# EAGLE design main-pcb@aveon (EAGLE 9.6.2)
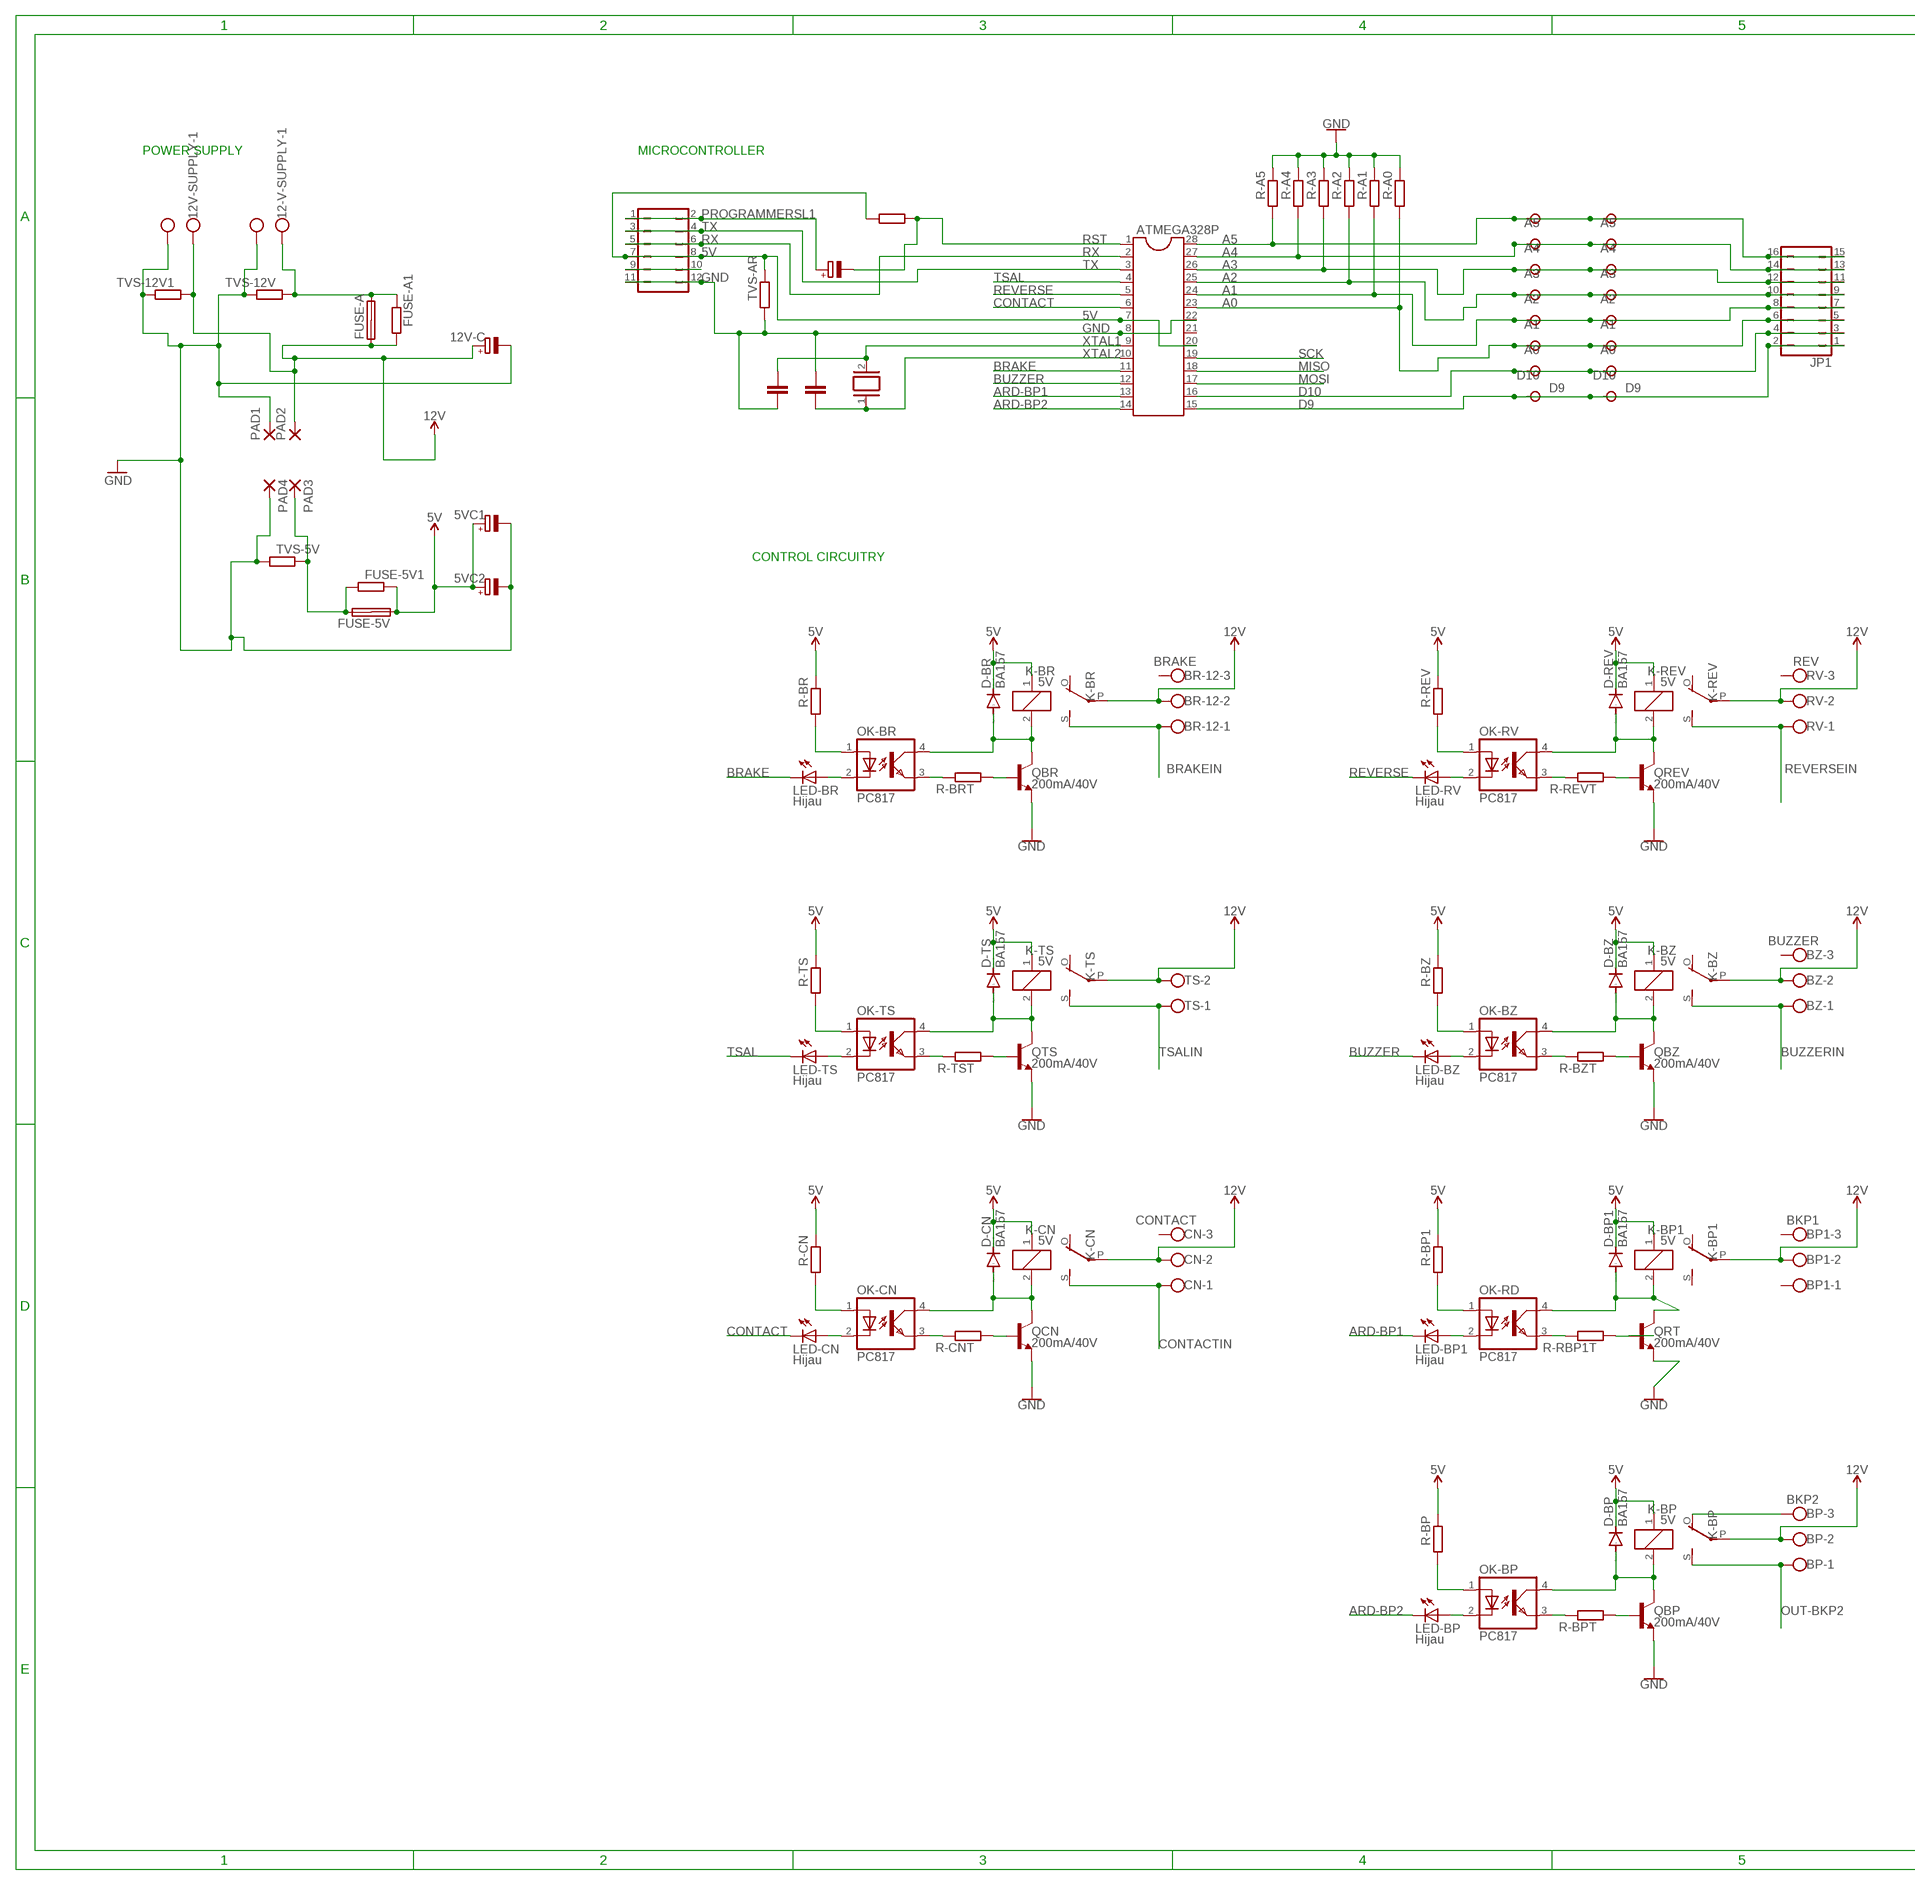
[diagram p0: schematic, sheet 1, part 1 of 2]
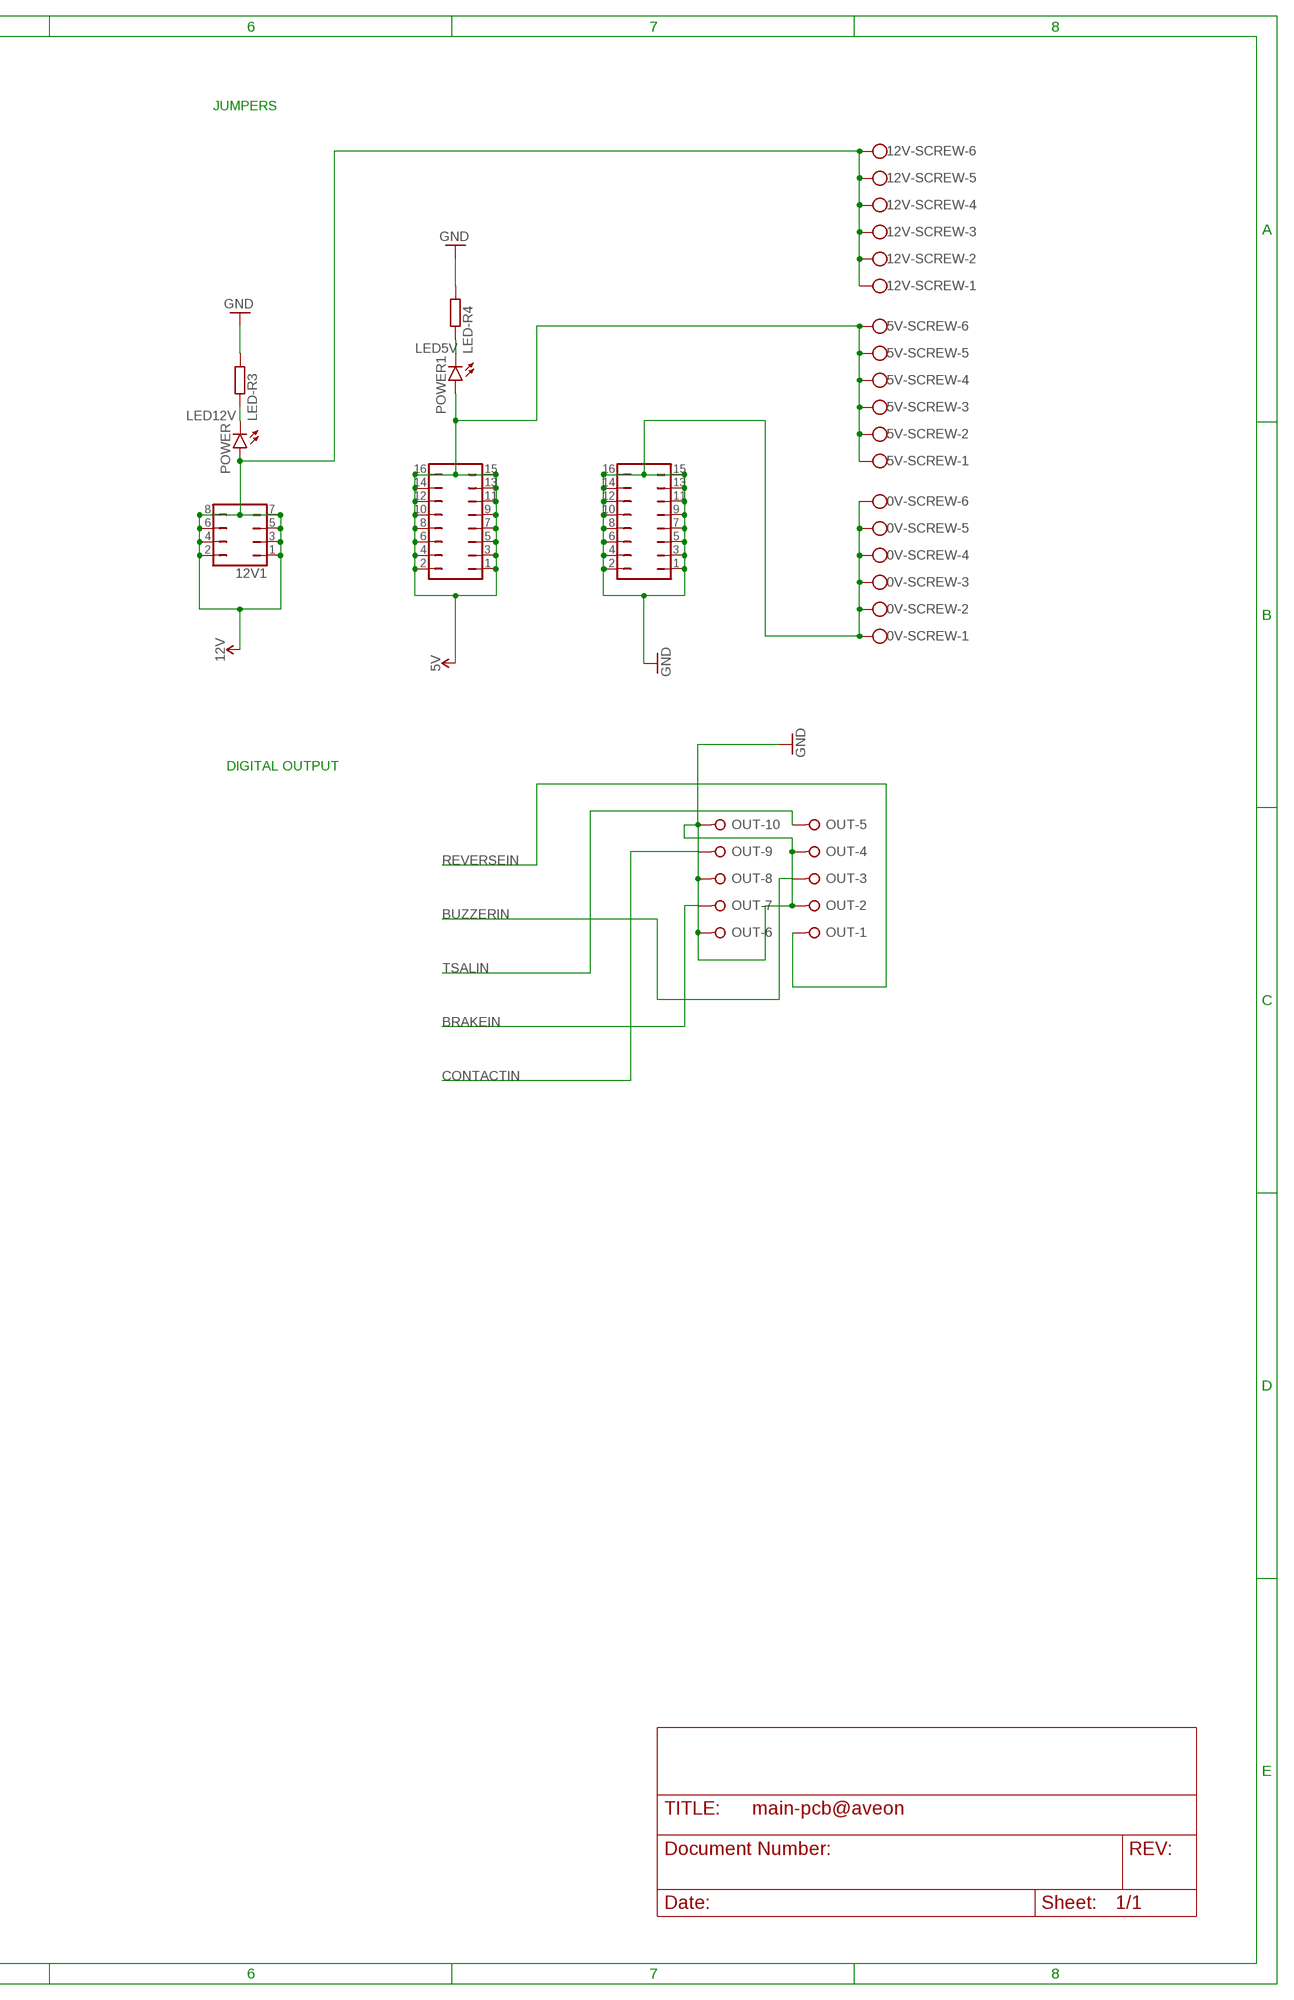
[diagram p1: schematic, sheet 1, part 2 of 2]

## Parts
0V-SCREW  W237-6  [W237-6]
5V  JP8Q  [JP8Q]
5V1  JP8Q  [JP8Q]
5V-SCREW  W237-6  [W237-6]
5VC1  CPOL-EUE5-10.5  [E5-10,5]
5VC-2  CPOL-EUE5-10.5  [E5-10,5]
12-V-SUPPLY  W237-102  [W237-102]
12V1  JP4Q  [JP4Q]
12V-C  CPOL-EUE5-10.5  [E5-10,5]
12V-SCREW  W237-6  [W237-6]
12V-SUPPLY  W237-102  [W237-102]
A-1  W237-08P  [W237-8P]
A-2  W237-08P  [W237-8P]
ATMEGA328P  DIL28-3  [DIL28-3]
BP  BKP2  W237-103  [W237-103]
BP1  BKP1  W237-103  [W237-103]
BR-12  BRAKE  W237-103  [W237-103]
BZ  BUZZER  W237-103  [W237-103]
C1  C-EU025-030X050  [C025-030X050]
C2  C-EU025-030X050  [C025-030X050]
CN  CONTACT  W237-103  [W237-103]
CRYSTAL  XTAL/S  [QS]
D-BP  BA157  [P1-10]
D-BP1  BA157  [P1-10]
D-BR  BA157  [P1-10]
D-BZ  BA157  [P1-10]
D-CN  BA157  [P1-10]
D-REV  BA157  [P1-10]
D-TS  BA157  [P1-10]
FUSE-5V  SHK20L  [SHK20L]
FUSE-5V1  R-EU_0204/7  [0204/7]
FUSE-A  SHK20L  [SHK20L]
FUSE-A1  R-EU_0204/7  [0204/7]
JP1  JP8Q  [JP8Q]
K-BP  5V  ZF112  [ZF112]
K-BP1  5V  ZF112  [ZF112]
K-BR  5V  ZF112  [ZF112]
K-BZ  5V  ZF112  [ZF112]
K-CN  5V  ZF112  [ZF112]
K-REV  5V  ZF112  [ZF112]
K-TS  5V  ZF112  [ZF112]
LED-BP  Hijau  LED3MM  [LED3MM]
LED-BP1  Hijau  LED3MM  [LED3MM]
LED-BR  Hijau  LED3MM  [LED3MM]
LED-BZ  Hijau  LED3MM  [LED3MM]
LED-CN  Hijau  LED3MM  [LED3MM]
LED-R3  R-EU_0204/7  [0204/7]
LED-R4  R-EU_0204/7  [0204/7]
LED-RV  Hijau  LED3MM  [LED3MM]
LED-TS  Hijau  LED3MM  [LED3MM]
OK-BP  PC817  [DIL04]
OK-BR  PC817  [DIL04]
OK-BZ  PC817  [DIL04]
OK-CN  PC817  [DIL04]
OK-RD  PC817  [DIL04]
OK-RV  PC817  [DIL04]
OK-TS  PC817  [DIL04]
OUT  W237-10P  [W237-10P]
PAD1  2,54/1,1  [2,54/1,1]
PAD2  2,54/1,1  [2,54/1,1]
PAD3  2,54/1,1  [2,54/1,1]
PAD4  2,54/1,1  [2,54/1,1]
POWER  LED5MM  [LED5MM]
POWER1  LED5MM  [LED5MM]
PROGRAMMER  JP6Q  [JP6Q]
QBP  200mA/40V  TRANS_NPN-2N3904  [TO-92]
QBR  200mA/40V  TRANS_NPN-2N3904  [TO-92]
QBZ  200mA/40V  TRANS_NPN-2N3904  [TO-92]
QCN  200mA/40V  TRANS_NPN-2N3904  [TO-92]
QREV  200mA/40V  TRANS_NPN-2N3904  [TO-92]
QRT  200mA/40V  TRANS_NPN-2N3904  [TO-92]
QTS  200mA/40V  TRANS_NPN-2N3904  [TO-92]
R-A0  R-EU_0204/7  [0204/7]
R-A1  R-EU_0204/7  [0204/7]
R-A2  R-EU_0204/7  [0204/7]
R-A3  R-EU_0204/7  [0204/7]
R-A4  R-EU_0204/7  [0204/7]
R-A5  R-EU_0204/7  [0204/7]
R-BP  R-EU_0204/7  [0204/7]
R-BP1  R-EU_0204/7  [0204/7]
R-BPT  R-EU_0204/7  [0204/7]
R-BR  R-EU_0204/7  [0204/7]
R-BRT  R-EU_0204/7  [0204/7]
R-BZ  R-EU_0204/7  [0204/7]
R-BZT  R-EU_0204/7  [0204/7]
R-CN  R-EU_0204/7  [0204/7]
R-CNT  R-EU_0204/7  [0204/7]
R-RBP1T  R-EU_0204/7  [0204/7]
R-REV  R-EU_0204/7  [0204/7]
R-REVT  R-EU_0204/7  [0204/7]
R-TS  R-EU_0204/7  [0204/7]
R-TST  R-EU_0204/7  [0204/7]
RST-C  CPOL-EUE2.5-6  [E2,5-6]
RST-R  R-EU_0204/7  [0204/7]
RV  REV  W237-103  [W237-103]
TS  TSAL  W237-103  [W237-103]
TVS-5V  R-EU_0204/7  [0204/7]
TVS-12V  R-EU_0204/7  [0204/7]
TVS-12V1  R-EU_0204/7  [0204/7]
TVS-AR  R-EU_0204/7  [0204/7]

## Nets
5V: 5V-SCREW.1 5V-SCREW.2 5V-SCREW.3 5V-SCREW.4 5V-SCREW.5 5V-SCREW.6 5V.1 5V.2 5V.3 5V.4 5V.5 5V.6 5V.7 5V.8 5V.9 5V.10 5V.11 5V.12 5V.13 5V.14 5V.15 5V.16 5VC1.+ 5VC-2.+ ATMEGA328P.7 ATMEGA328P.20 D-BP1.C D-BP.C D-BR.C D-BZ.C D-CN.C D-REV.C D-TS.C FUSE-5V1.2 FUSE-5V.1A K-BP1.1 K-BP.1 K-BR.1 K-BZ.1 K-CN.1 K-REV.1 K-TS.1 POWER1.A PROGRAMMER.7 PROGRAMMER.8 R-BP1.2 R-BP.2 R-BR.2 R-BZ.2 R-CN.2 R-REV.2 R-TS.2 RST-R.1 TVS-AR.2
12V: 12V1.1 12V1.2 12V1.3 12V1.4 12V1.5 12V1.6 12V1.7 12V1.8 12V-C.+ 12V-SCREW.1 12V-SCREW.2 12V-SCREW.3 12V-SCREW.4 12V-SCREW.5 12V-SCREW.6 12V-SUPPLY.1 BP1.2 BP.2 BR-12.2 BZ.2 CN.2 FUSE-A1.1 FUSE-A.1A K-BP1.P(2:P) K-BP.P(2:P) K-BR.P(2:P) K-BZ.P(2:P) K-CN.P(2:P) K-REV.P(2:P) K-TS.P(2:P) PAD2.1(P) POWER.A RV.2 TS.2 TVS-12V1.1
A0: A-1.3 A-2.3 ATMEGA328P.23 JP1.5 JP1.6 R-A0.1
A1: A-1.4 A-2.4 ATMEGA328P.24 JP1.7 JP1.8 R-A1.1
A2: A-1.5 A-2.5 ATMEGA328P.25 JP1.9 JP1.10 R-A2.1
A3: A-1.6 A-2.6 ATMEGA328P.26 JP1.11 JP1.12 R-A3.1
A4: A-1.7 A-2.7 ATMEGA328P.27 JP1.13 JP1.14 R-A4.1
A5: A-1.8 A-2.8 ATMEGA328P.28 JP1.15 JP1.16 R-A5.1
ARD-BP1: ATMEGA328P.13 LED-BP1.K(C)
ARD-BP2: ATMEGA328P.14 LED-BP.K(C)
BRAKE: ATMEGA328P.11 LED-BR.K(C)
BRAKEIN: BR-12.1 K-BR.S(2:S) OUT.7
BUZZER: ATMEGA328P.12 LED-BZ.K(C)
BUZZERIN: BZ.1 K-BZ.S(2:S) OUT.3
CONTACT: ATMEGA328P.6 LED-CN.K(C)
CONTACTIN: CN.1 K-CN.S(2:S) OUT.9
D9: A-1.1 A-2.1 ATMEGA328P.15 JP1.1 JP1.2
D10: A-1.2 A-2.2 ATMEGA328P.16 JP1.3 JP1.4
GND: 0V-SCREW.1 0V-SCREW.2 0V-SCREW.3 0V-SCREW.4 0V-SCREW.5 0V-SCREW.6 5V1.1 5V1.2 5V1.3 5V1.4 5V1.5 5V1.6 5V1.7 5V1.8 5V1.9 5V1.10 5V1.11 5V1.12 5V1.13 5V1.14 5V1.15 5V1.16 5VC1.- 5VC-2.- 12-V-SUPPLY.2 12V-C.- 12V-SUPPLY.2 ATMEGA328P.8 ATMEGA328P.22 C1.1 C2.2 LED-R3.1 LED-R4.1 OUT.2 OUT.4 OUT.6 OUT.8 OUT.10 PAD1.1(P) PAD4.1(P) PROGRAMMER.11 PROGRAMMER.12 QBP.1(E) QBR.1(E) QBZ.1(E) QCN.1(E) QREV.1(E) QRT.1(E) QTS.1(E) R-A0.2 R-A1.2 R-A2.2 R-A3.2 R-A4.2 R-A5.2 TVS-5V.1 TVS-12V1.2 TVS-12V.2 TVS-AR.1
LED5V: LED-R4.2 POWER1.K(C)
LED12V: LED-R3.2 POWER.K(C)
MISO: ATMEGA328P.18
MOSI: ATMEGA328P.17
N$3: 12-V-SUPPLY.1 FUSE-A1.2 FUSE-A.2A TVS-12V.1
N$4: OK-BR.1(A) R-BR.1
N$5: FUSE-5V1.1 FUSE-5V.2A PAD3.1(P) TVS-5V.2
N$8: OK-RV.1(A) R-REV.1
N$10: LED-RV.A OK-RV.2(C)
N$11: LED-BR.A OK-BR.2(C)
N$12: OK-BR.3(EMIT) R-BRT.2
N$13: D-BR.A K-BR.2 OK-BR.4(COL) QBR.3(C)
N$14: QBR.2(B) R-BRT.1
N$18: OK-TS.1(A) R-TS.1
N$19: LED-TS.A OK-TS.2(C)
N$22: OK-TS.3(EMIT) R-TST.2
N$23: QTS.2(B) R-TST.1
N$24: D-TS.A K-TS.2 OK-TS.4(COL) QTS.3(C)
N$26: OK-RV.3(EMIT) R-REVT.2
N$28: QREV.2(B) R-REVT.1
N$29: D-REV.A K-REV.2 OK-RV.4(COL) QREV.3(C)
N$31: OK-BZ.1(A) R-BZ.1
N$32: LED-BZ.A OK-BZ.2(C)
N$33: OK-BZ.3(EMIT) R-BZT.2
N$34: QBZ.2(B) R-BZT.1
N$35: D-BZ.A K-BZ.2 OK-BZ.4(COL) QBZ.3(C)
N$37: OK-CN.1(A) R-CN.1
N$38: LED-CN.A OK-CN.2(C)
N$39: OK-CN.3(EMIT) R-CNT.2
N$40: QCN.2(B) R-CNT.1
N$41: D-CN.A K-CN.2 OK-CN.4(COL) QCN.3(C)
N$43: OK-RD.1(A) R-BP1.1
N$44: LED-BP1.A OK-RD.2(C)
N$45: OK-RD.3(EMIT) R-RBP1T.2
N$46: QRT.2(B) R-RBP1T.1
N$47: D-BP1.A K-BP1.2 OK-RD.4(COL) QRT.3(C)
N$55: OK-BP.1(A) R-BP.1
N$56: LED-BP.A OK-BP.2(C)
N$57: OK-BP.3(EMIT) R-BPT.2
N$58: QBP.2(B) R-BPT.1
N$59: D-BP.A K-BP.2 OK-BP.4(COL) QBP.3(C)
N$66: PROGRAMMER.9 PROGRAMMER.10
N$76: BP.3 K-BP.O(2:O)
OUT-BKP2: BP.1 K-BP.S(2:S)
PROGRAMMERSL1: PROGRAMMER.1 PROGRAMMER.2 RST-C.+
REVERSE: ATMEGA328P.5 LED-RV.K(C)
REVERSEIN: K-REV.S(2:S) OUT.1 RV.1
RST: ATMEGA328P.1 RST-C.- RST-R.2
RX: ATMEGA328P.2 PROGRAMMER.5 PROGRAMMER.6
SCK: ATMEGA328P.19
TSAL: ATMEGA328P.4 LED-TS.K(C)
TSALIN: K-TS.S(2:S) OUT.5 TS.1
TX: ATMEGA328P.3 PROGRAMMER.3 PROGRAMMER.4
XTAL1: ATMEGA328P.9 C1.2 CRYSTAL.2
XTAL2: ATMEGA328P.10 C2.1 CRYSTAL.1
Unconnected: ATMEGA328P.21 BP1.1 BP1.3 BR-12.3 BZ.3 CN.3 FUSE-5V.1B FUSE-5V.2B FUSE-A.1B FUSE-A.2B K-BP1.O(2:O) K-BP1.S(2:S) K-BR.O(2:O) K-BZ.O(2:O) K-CN.O(2:O) K-REV.O(2:O) K-TS.O(2:O) RV.3 TS.3

## Notes on the sheet
- JUMPERS
- POWER SUPPLY | MICROCONTROLLER
- CONTROL CIRCUITRY
- DIGITAL OUTPUT

## Library data of the parts
0V-SCREW 5V-SCREW 12V-SCREW = con-wago-500:W237-6: WAGO SCREW CLAMP; OC_FARNELL: unknown; OC_NEWARK: unknown
5V 5V1 JP1 = jumper:JP8Q: JUMPER
5VC1 5VC-2 12V-C RST-C = rcl:CPOL-EU: POLARIZED CAPACITOR, European symbol; SPICEPREFIX: C
12-V-SUPPLY 12V-SUPPLY = con-wago-500:W237-102: WAGO SCREW CLAMP; MPN: 237-102; OC_FARNELL: unknown; OC_NEWARK: 70K9898
12V1 = jumper:JP4Q: JUMPER
A-1 = con-wago-508:W237-08P: WAGO SREW CLAMP; A0: 123; OC_FARNELL: unknown; OC_NEWARK: unknown
A-2 = con-wago-508:W237-08P: WAGO SREW CLAMP; OC_FARNELL: unknown; OC_NEWARK: unknown
ATMEGA328P = ic-package:DIL28: Dual In Line
BP BP1 BR-12 BZ CN RV TS = con-wago-500:W237-103: WAGO SCREW CLAMP; MPN: 237-103; OC_FARNELL: unknown; OC_NEWARK: 18M7116
C1 C2 = rcl:C-EU: CAPACITOR, European symbol; SPICEPREFIX: C
CRYSTAL = special:XTAL/S: CRYSTAL
D-BP D-BP1 D-BR D-BZ D-CN D-REV D-TS = diode:BA157: DIODE fast soft-recovery controlled avalanche rectifier
FUSE-5V FUSE-A = fuse:SHK20L: FUSE HOLDER 5 x 20 mm, SH contact, SHH1 Schukat, E1073 Buerklin; OC_FARNELL: unknown; OC_NEWARK: unknown
FUSE-5V1 FUSE-A1 LED-R3 LED-R4 R-A0 R-A1-R-A5 R-BP R-BP1 R-BPT R-BR R-BRT R-BZ R-BZT R-CN R-CNT R-RBP1T R-REV R-REVT R-TS R-TST RST-R TVS-5V TVS-12V TVS-12V1 TVS-AR = rcl:R-EU_: RESISTOR, European symbol; SPICEPREFIX: R
K-BP K-BP1 K-BR K-BZ K-CN K-REV K-TS = relay:ZF112: RELAY 1 x switch; OC_FARNELL: unknown; OC_NEWARK: unknown
LED-BP LED-BP1 LED-BR LED-BZ LED-CN LED-RV LED-TS POWER POWER1 = led:LED: LED OSRAM: - CHIPLED LG R971, LG N971, LY N971, LG Q971, LY Q971, LO R971, LY R971 LH N974, LH R974 LS Q976, LO Q976, LY Q976 LO Q996 - Hyper CHIPLED LW Q18S LB Q993, LB Q99A, LB R99A - SideLED LS A670, LO A670, LY A670, LG A670, LP A670 LB A673, LV A673, LT A673, LW A673 LH A674 LY A675 LS A676, LA A676, LO A676, LY A676, LW A676 LS A679, LY A679, LG A679 - Hyper Micro SIDELED® LS Y876, LA Y876, LO Y876, LY Y876 LT Y87S - SmartLED LW L88C, LW L88S LB L89C, LB L89S, LG L890 LS L89K, LO L89K, LY L89K LS L896, LA L896, LO L896, LY L896 - TOPLED LS T670, LO T670, LY T670, LG T670, LP T670 LSG T670, LSP T670, LSY T670, LOP T670, LYG T670 LG T671, LOG T671, LSG T671 LB T673, LV T673, LT T673, LW T673 LH T674 LS T676, LA T676, LO T676, LY T676, LB T676, LH T676, LSB T676, LW T676 LB T67C, LV T67C, LT T67C, LS T67K, LO T67K, LY T67K, LW E67C LS E67B, LA E67B, LO E67B, LY E67B, LB E67C, LV E67C, LT E67C LW T67C LS T679, LY T679, LG T679 LS T770, LO T770, LY T770, LG T770, LP T770 LB T773, LV T773, LT T773, LW T773 LH T774 LS E675, LA E675, LY E675, LS T675 LS T776, LA T776, LO T776, LY T776, LB T776 LHGB T686 LT T68C, LB T68C - Hyper Mini TOPLED® LB M676 - Mini TOPLED Santana® LG M470 LS M47K, LO M47K, LY M47K Source: http://www.osram.convergy.de LUXEON: - LUMILED® LXK2-PW12-R00, LXK2-PW12-S00, LXK2-PW14-U00, LXK2-PW14-V00 LXK2-PM12-R00, LXK2-PM12-S00, LXK2-PM14-U00 LXK2-PE12-Q00, LXK2-PE12-R00, LXK2-PE12-S00, LXK2-PE14-T00, LXK2-PE14-U00 LXK2-PB12-K00, LXK2-PB12-L00, LXK2-PB12-M00, LXK2-PB14-N00, LXK2-PB14-P00, LXK2-PB14-Q00 LXK2-PR12-L00, LXK2-PR12-M00, LXK2-PR14-Q00, LXK2-PR14-R00 LXK2-PD12-Q00, LXK2-PD12-R00, LXK2-PD12-S00 LXK2-PH12-R00, LXK2-PH12-S00 LXK2-PL12-P00, LXK2-PL12-Q00, LXK2-PL12-R00 Source: www.luxeon.com KINGBRIGHT: KA-3528ASYC Source: www.kingbright.com
OK-BP OK-BR OK-BZ OK-CN OK-RD OK-RV OK-TS = optocoupler:PC817: SHARP OPTO COUPLER; MPN: PC817X4J000F; OC_FARNELL: 9707727; OC_NEWARK: 97K7059
OUT = con-wago-508:W237-10P: WAGO SREW CLAMP; OC_FARNELL: unknown; OC_NEWARK: unknown
PAD1-PAD4 = wirepad:2,54/1,1: THROUGH-HOLE PAD
PROGRAMMER = jumper:JP6Q: JUMPER
QBP QBR QBZ QCN QREV QRT QTS = SparkFun-DiscreteSemi:TRANS_NPN: NPN transistor Current controlled devices typically used to amplify current or used as a switch. BC547 - COM-08928 <http://www.sparkfun.com/products/8928> (TO-92 45V 100mA) (1.Collector 2.Base 3.Emitter) 2N3904 - COM-00521 <http://www.sparkfun.com/products/521> (TO-92 40V 200mA) (1.Emitter 2.Base 3.Collector) P2N2222A - COM-12852 <http://www.sparkfun.com/products/12852> (TO-92 40V 600mA) (1.Collector 2.Base 3.Emitter); PROD_ID: TRANS-08447

## Board
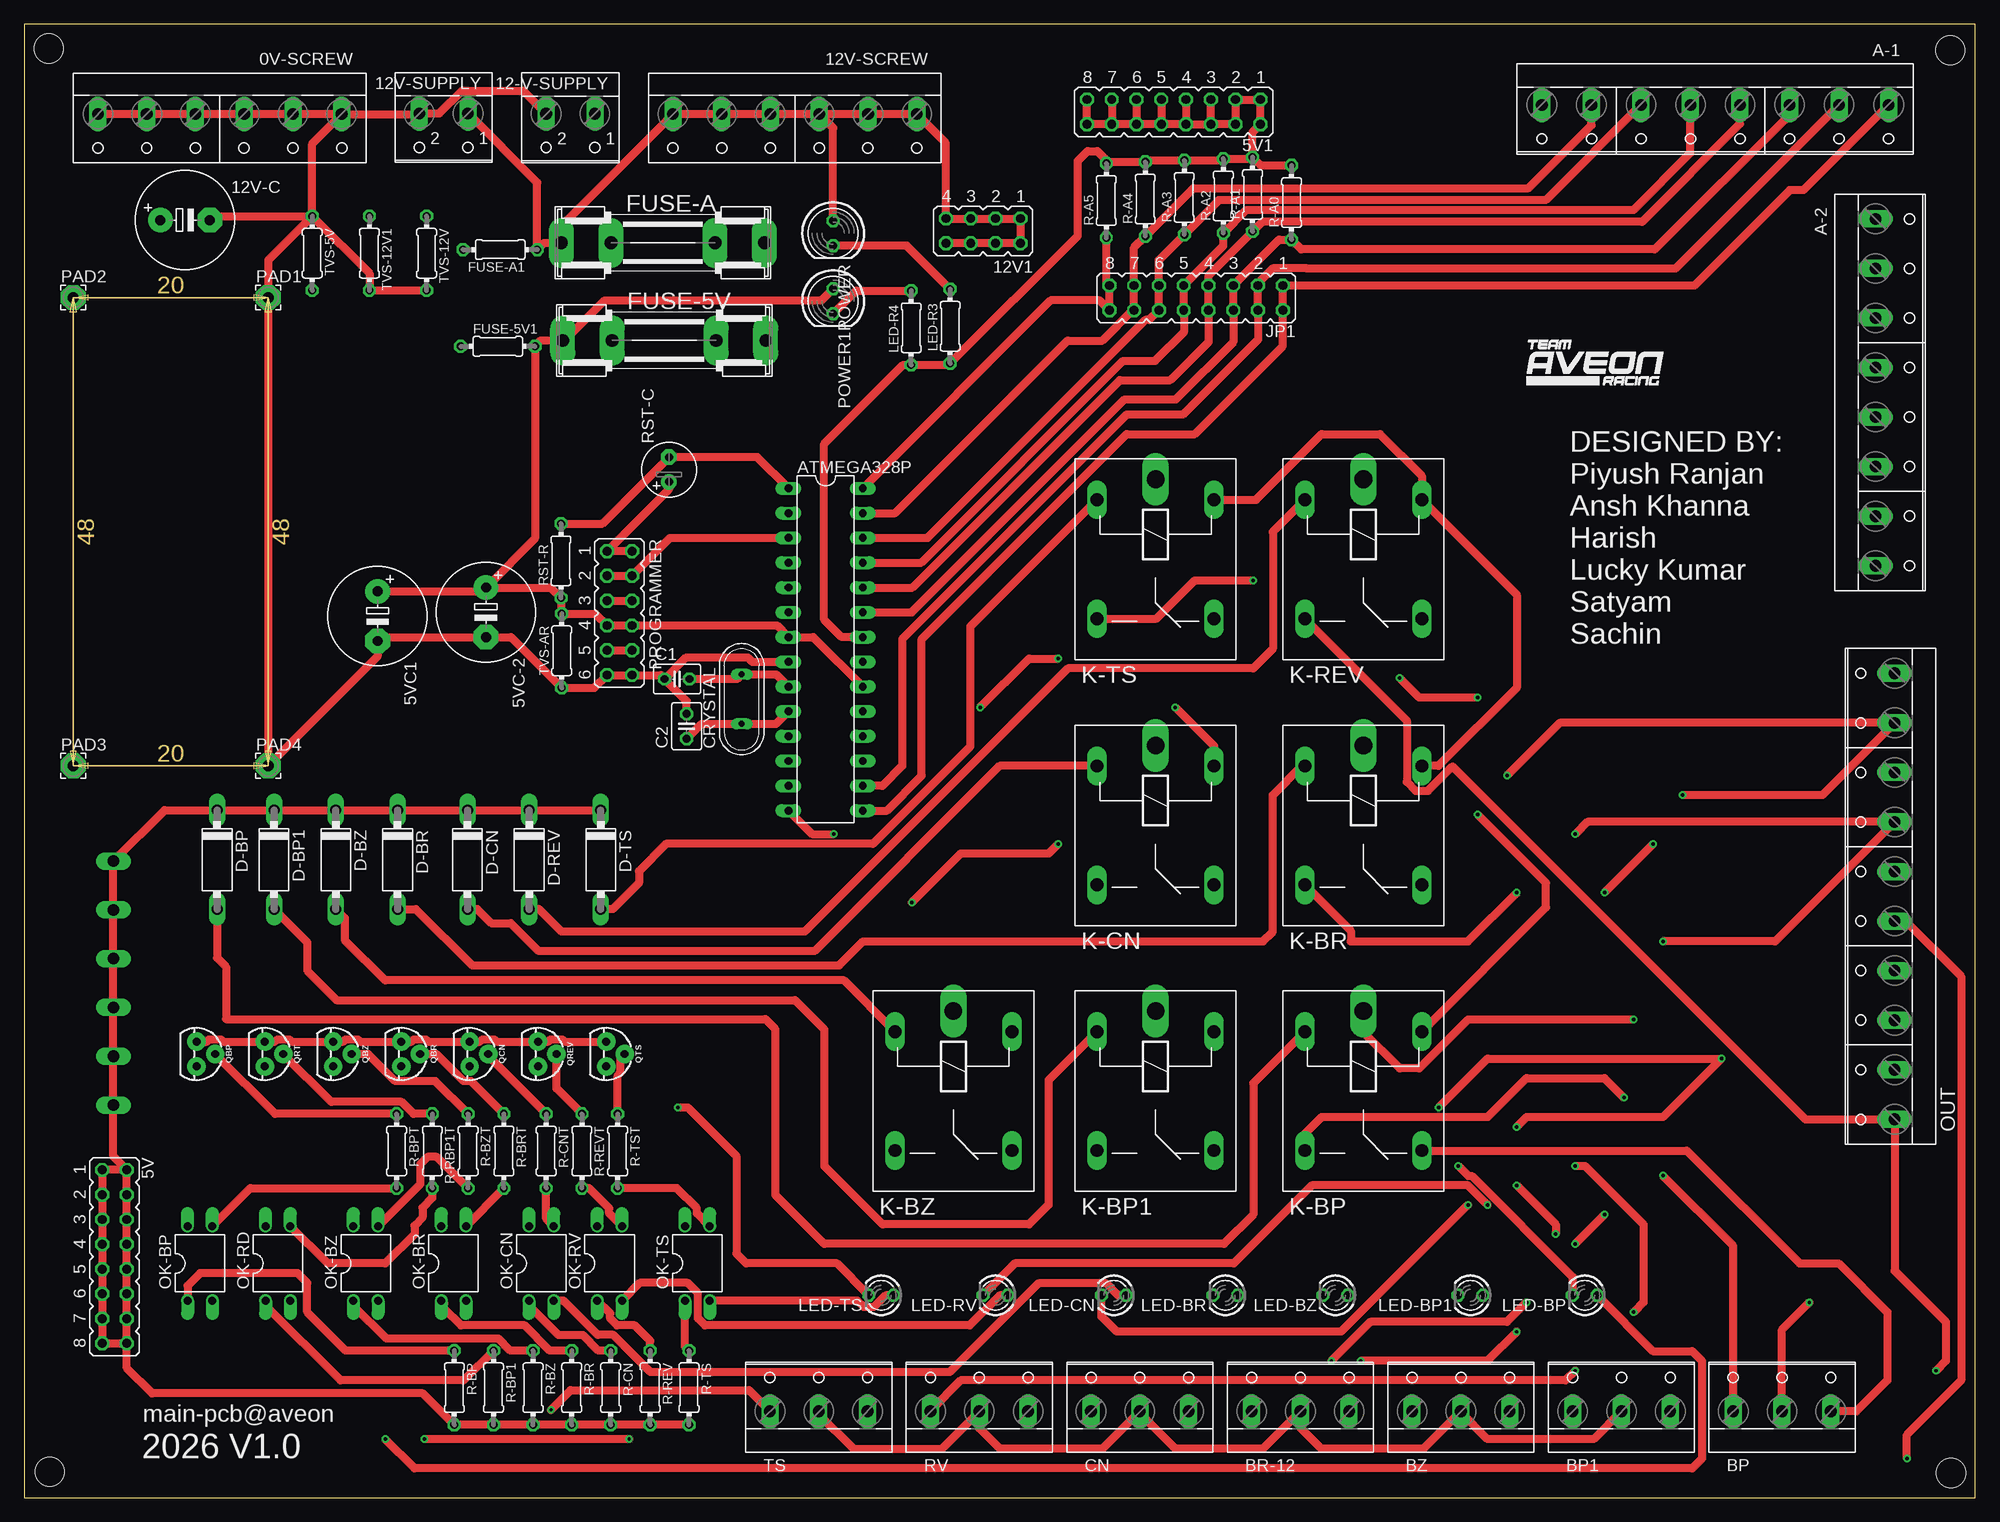
[diagram p2: board, top side]
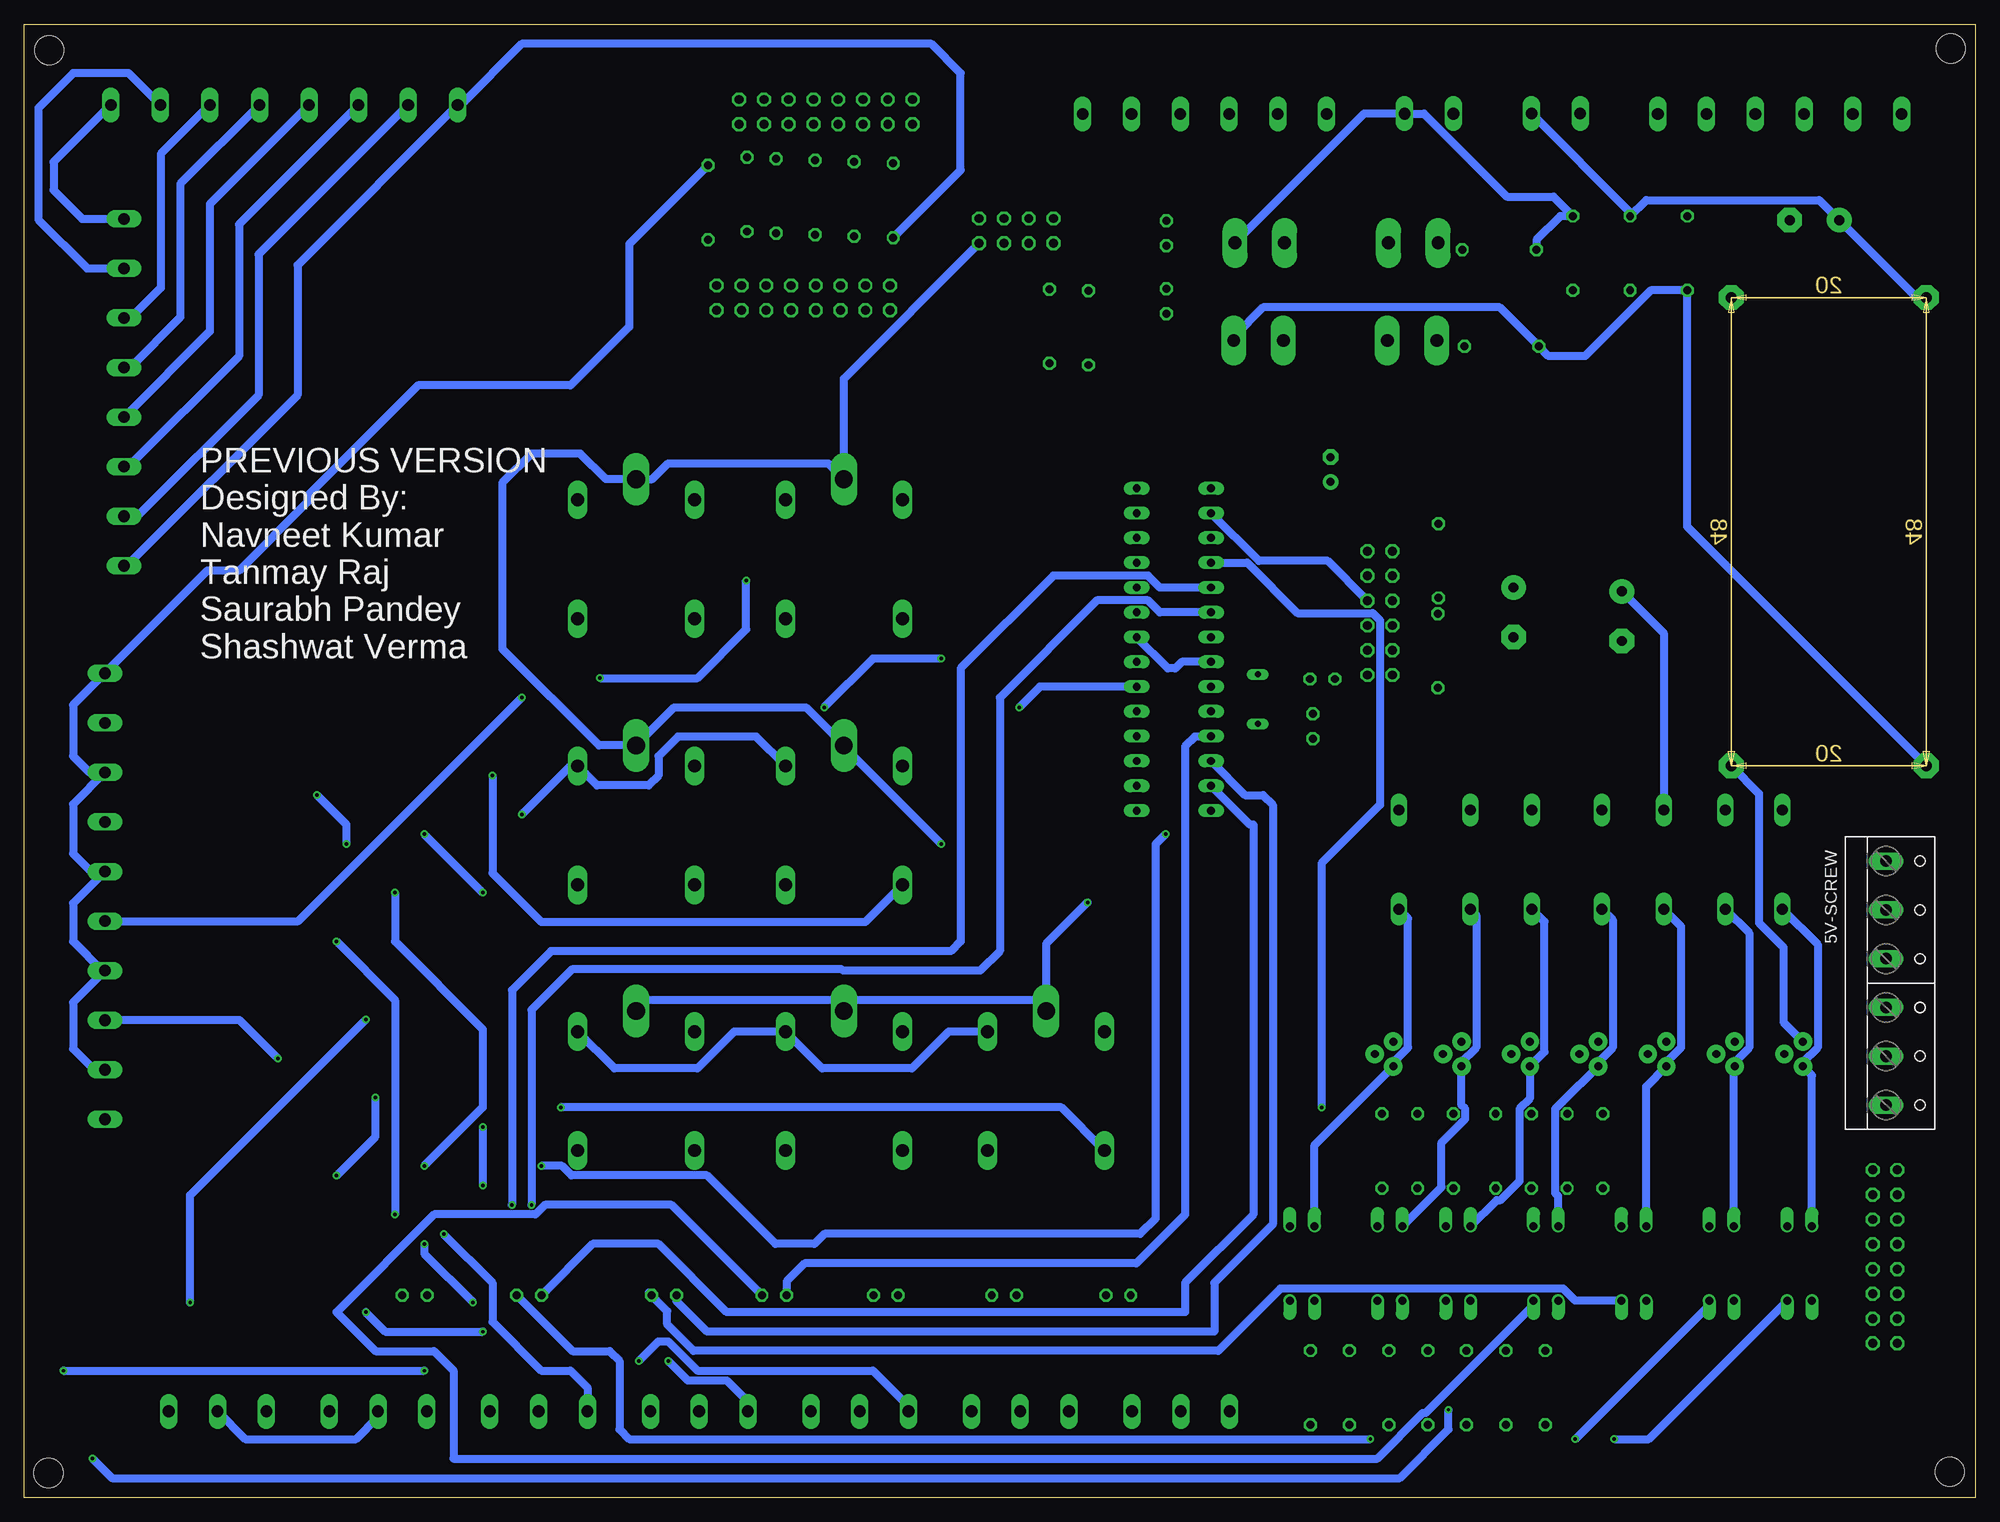
[diagram p3: board, bottom side, seen from below]

Size 200 x 151 mm. Coordinates in mm from the lower left corner, seen from the top.
Outline: 0,0 200,0 200,151 0,151 0,0
Copper layers (1*16): Top 0.035mm / dielectric 1.5mm / Bottom 0.035mm
Design rules "default": minimum track width 6mil, minimum drill 0.35mm, track to track 6mil, track to pad 6mil, pad to pad 6mil, via to via 6mil, smd to smd 6mil, copper to edge 40mil, drill to drill 6mil, minimum pad ring 10mil, minimum via ring 8mil, stop-mask expansion 4mil, vias tented up to drill 0mil, thermal gap 10mil
Holes 3 mm at 2.59,2.64 197.52,2.52 197.46,148.35 2.48,148.53

### Footprints (pad centres in the part's own frame; a part is rotated, then mirrored left to right if it is on the bottom)
W237-6 = drill 1.194 long: 1 -12.5,-1.27; 2 -7.5,-1.27; 3 -2.5,-1.27; 4 2.5,-1.27; 5 7.5,-1.27; 6 12.5,-1.27
JP8Q = drill 0.914 octagon: 1 -8.89,-1.27; 2 -8.89,1.27; 3 -6.35,-1.27; 4 -6.35,1.27; 5 -3.81,-1.27; 6 -3.81,1.27; 7 -1.27,-1.27; 8 -1.27,1.27; 9 1.27,-1.27; 10 1.27,1.27; 11 3.81,-1.27; 12 3.81,1.27; 13 6.35,-1.27; 14 6.35,1.27; 15 8.89,-1.27; 16 8.89,1.27
E5-10,5 = drill 1.016 pad 2.54: + -2.54,0 | drill 1.016 pad 2.54 octagon: - 2.54,0
W237-102 = drill 1.194 long: 1 -2.5,-1.27; 2 2.5,-1.27
JP4Q = drill 0.914 octagon: 1 -3.81,-1.27; 2 -3.81,1.27; 3 -1.27,-1.27; 4 -1.27,1.27; 5 1.27,-1.27; 6 1.27,1.27; 7 3.81,-1.27; 8 3.81,1.27
W237-8P = drill 1.194 long: 1 -17.78,-0.635; 2 -12.7,-0.635; 3 -7.62,-0.635; 4 -2.54,-0.635; 5 2.54,-0.635; 6 7.62,-0.635; 7 12.7,-0.635; 8 17.78,-0.635
DIL28-3 = drill 0.813 long: 1 -16.51,-3.81; 2 -13.97,-3.81; 3 -11.43,-3.81; 4 -8.89,-3.81; 5 -6.35,-3.81; 6 -3.81,-3.81; 7 -1.27,-3.81; 8 1.27,-3.81; 9 3.81,-3.81; 10 6.35,-3.81; 11 8.89,-3.81; 12 11.43,-3.81; 13 13.97,-3.81; 14 16.51,-3.81; 15 16.51,3.81; 16 13.97,3.81; 17 11.43,3.81; 18 8.89,3.81; 19 6.35,3.81; 20 3.81,3.81; 21 1.27,3.81; 22 -1.27,3.81; 23 -3.81,3.81; 24 -6.35,3.81; 25 -8.89,3.81; 26 -11.43,3.81; 27 -13.97,3.81; 28 -16.51,3.81
W237-103 = drill 1.194 long: 1 -5,-1.29; 2 0,-1.29; 3 5,-1.29
C025-030X050 = drill 0.813 octagon: 1 -1.27,0; 2 1.27,0
QS = drill 0.61 long: 1 -2.54,0; 2 2.54,0
P1-10 = drill 1.118 long: A 5.08,0; C -5.08,0
SHK20L = drill 1.321 pad 2.54 long: 1A -10.414,0; 1B -5.334,0; 2A 10.414,0; 2B 5.334,0
0204/7 = drill 0.813 octagon: 1 -3.81,0; 2 3.81,0
ZF112 = drill 1.321 long: 1 -6.096,5.994; 2 -6.096,-5.994; O 6.096,5.994; S 6.096,-5.994 | drill 1.803 long: P -8.204,0
LED3MM = drill 0.813 octagon: A -1.27,0; K 1.27,0
DIL04 = drill 0.813 offset: 1 -1.27,-3.81; 2 1.27,-3.81; 3 1.27,3.81; 4 -1.27,3.81
W237-10P = drill 1.194 long: 1 -22.86,-0.635; 2 -17.78,-0.635; 3 -12.7,-0.635; 4 -7.62,-0.635; 5 -2.54,-0.635; 6 2.54,-0.635; 7 7.62,-0.635; 8 12.7,-0.635; 9 17.78,-0.635; 10 22.86,-0.635
2,54/1,1 = drill 1.118 pad 2.54 octagon: 1 0,0
LED5MM = drill 0.813 octagon: A -1.27,0; K 1.27,0
JP6Q = drill 0.914 octagon: 1 -6.35,-1.27; 2 -6.35,1.27; 3 -3.81,-1.27; 4 -3.81,1.27; 5 -1.27,-1.27; 6 -1.27,1.27; 7 1.27,-1.27; 8 1.27,1.27; 9 3.81,-1.27; 10 3.81,1.27; 11 6.35,-1.27; 12 6.35,1.27
TO-92 = drill 0.813 pad 1.88: 1 -1.27,0; 2 0,1.905; 3 1.27,0
E2,5-6 = drill 0.813 pad 1.6: + -1.27,0 | drill 0.813 pad 1.6 octagon: - 1.27,0

### Placement (x,y rotation side)
0V-SCREW  20.04,140.54 180 top
5V  9.24,24.69 270 top
5V1  117.83,142.03 180 top
5V-SCREW  7.86,52.74 270 bottom
5VC1  36.21,90.34 270 top
5VC-2  47.32,90.74 270 top
12-V-SUPPLY  56,140.57 180 top
12V1  98.3,129.83 180 top
12V-C  16.48,130.94 0 top
12V-SCREW  78.99,140.54 180 top
12V-SUPPLY  42.99,140.6 180 top
A-1  173.36,142.12 180 top
A-2  190.42,113.29 270 top
ATMEGA328P  82.15,86.93 270 top
BP  180.2,10.13 0 top
BP1  163.74,10.13 0 top
BR-12  130.82,10.13 0 top
BZ  147.28,10.13 0 top
C1  66.91,83.9 0 top
C2  67.9,79.06 90 top
CN  114.36,10.13 0 top
CRYSTAL  73.54,81.84 90 top
D-BP  19.76,65.39 270 top
D-BP1  25.59,65.39 270 top
D-BR  38.26,65.39 270 top
D-BZ  31.93,65.39 270 top
D-CN  45.43,65.39 270 top
D-REV  51.76,65.39 270 top
D-TS  59.09,65.39 270 top
FUSE-5V  65.6,118.6 0 top
FUSE-5V1  48.54,118 0 top
FUSE-A  65.47,128.6 0 top
FUSE-A1  48.78,127.92 180 top
JP1  120.13,122.97 180 top
K-BP  137.28,41.66 270 top
K-BP1  115.97,41.66 270 top
K-BR  137.28,68.89 270 top
K-BZ  95.25,41.66 270 top
K-CN  115.97,68.89 270 top
K-REV  137.28,96.17 270 top
K-TS  115.97,96.17 270 top
LED-BP  159.98,20.73 180 top
LED-BP1  148.26,20.73 180 top
LED-BR  123.12,20.73 180 top
LED-BZ  134.41,20.73 180 top
LED-CN  111.69,20.73 180 top
LED-R3  94.92,120.06 90 top
LED-R4  90.92,119.9 90 top
LED-RV  99.55,20.73 180 top
LED-TS  87.84,20.73 180 top
OK-BP  18,24 0 top
OK-BR  44,24 0 top
OK-BZ  35,24 0 top
OK-CN  53,24 0 top
OK-RD  26,24 0 top
OK-RV  60,24 0 top
OK-TS  69,24 0 top
OUT  191.12,61.63 90 top
PAD1  25,123 0 top
PAD2  5,123 0 top
PAD3  5,75 0 top
PAD4  25,75 0 top
POWER  82.92,129.6 270 top
POWER1  82.92,122.63 270 top
PROGRAMMER  61.02,90.66 270 top
QBP  17.65,45.47 270 top
QBR  38.65,45.47 270 top
QBZ  31.65,45.47 270 top
QCN  45.65,45.47 270 top
QREV  52.65,45.47 270 top
QRT  24.65,45.47 270 top
QTS  59.65,45.47 270 top
R-A0  129.92,132.74 90 top
R-A1  125.92,133.58 90 top
R-A2  122.92,133.42 90 top
R-A3  118.92,133.26 90 top
R-A4  114.92,133.1 90 top
R-A5  110.92,132.94 90 top
R-BP  44.08,11.26 270 top
R-BP1  48.09,11.26 270 top
R-BPT  38.16,35.52 270 top
R-BR  56.12,11.26 270 top
R-BRT  49.16,35.52 270 top
R-BZ  52.15,11.26 270 top
R-BZT  45.49,35.52 270 top
R-CN  60.11,11.26 270 top
R-CNT  53.49,35.52 270 top
R-RBP1T  41.83,35.52 270 top
R-REV  64.16,11.26 270 top
R-REVT  57.16,35.52 270 top
R-TS  68.13,11.26 270 top
R-TST  60.83,35.52 270 top
RST-C  66.09,105.37 90 top
RST-R  55.01,96.02 90 top
RV  97.9,10.13 0 top
TS  81.44,10.13 0 top
TVS-5V  29.51,127.55 270 top
TVS-12V  41.24,127.55 270 top
TVS-12V1  35.38,127.55 270 top
TVS-AR  55.09,86.8 90 top

### Tracks (layer width: path | path; a pad name or v marks a point on that pad's centre or on a via)
5V  (via drill 0.35)
  Top 0.813: ATMEGA328P.20 80.88,88.2 ATMEGA328P.7 77.15,89.39 PROGRAMMER.8 PROGRAMMER.7 58.53,90.61 TVS-AR.2 55.01,90.69 RST-R.1 53.94,93.28 5VC-2.+ | 5VC1.+ 46.92,92.88 5VC-2.+ | 5VC-2.+ 52.35,98.31 FUSE-5V1.2 52.95,118.6 FUSE-5V.1A 55.41,118.6 59.51,122.7 81.72,122.7 POWER1.A | R-TS.2 R-REV.2 R-CN.2 R-BR.2 R-BZ.2 R-BP1.2 R-BP.2 40.85,10.68 13.09,10.68 10.51,13.26 5V.16 | 5V.2 5V.4 5V.6 5V.8 5V.10 5V.12 5V.14 5V.16 | 5V.2 5V.1 5V.3 5V.5 5V.7 5V.9 5V.11 5V.13 5V.15 5V.16 | D-TS.C D-REV.C D-CN.C D-BR.C D-BZ.C D-BP1.C D-BP.C 14.37,70.47 5V-SCREW.1 5V-SCREW.2 5V-SCREW.3 5V-SCREW.4 5V-SCREW.5 5V-SCREW.6 9.13,34.96 5V.2 | K-TS.1 126.27,102.27 133,109 139,109 143.27,104.73 K-REV.1 153,92.55 153,83 144.99,74.99 K-BR.1 | v98,81 103,86 v106,86 | v118,81 121.97,77.03 K-CN.1 | K-BP.1 156,60.49 156,63 v149,70
  Bottom 0.813: 5VC1.+ 31.93,88.6 D-BZ.C | ATMEGA328P.20 95.88,83.12 v98,81 | v106,86 113,86 v118,81 | K-CN.1 124.98,78 133,78 135,76 135,74 136,73 141.29,73 K-BR.1 144.01,74.99 v149,70 | K-BZ.1 105.24,47.76 109,44 118.2,44 K-BP1.1 127.24,47.76 131,44 139.51,44 K-BP.1
12V  (via drill 0.35)
  Top 0.813: 12V-SCREW.3 12V-SCREW.2 12V-SCREW.1 94.49,138.82 12V1.7 12V1.5 12V1.3 12V1.1 12V1.2 12V1.4 12V1.6 12V1.8 | 12V-SCREW.3 12V-SCREW.4 12V-SCREW.5 12V-SCREW.6 55.06,130.38 FUSE-A.1A 53.27,128.6 FUSE-A1.1 52.59,134.77 12V-SUPPLY.1 | POWER.A 82.92,140.39 12V-SCREW.3 | v106,67 105,66 96,66 v91,61 | BP1.2 160.9,6 150,6 147.28,8.72 BZ.2 143.44,5 133,5 130.82,7.18 BR-12.2 126.98,5 118,5 114.36,8.64 CN.2 110.52,5 100,5 97.9,7.1 RV.2 94.06,5 85,5 81.44,8.56 TS.2 | BP.2 180.2,17.2 v183,20 | v165,49 148,49 143,44 141,44 137.28,47.72 K-BP.P
  Bottom 0.813: 12V-SUPPLY.1 35.38,131.76 TVS-12V1.1 33.73,133 16,133 12V-C.+ 6,123 PAD2.1 | 12V1.2 115.97,114.7 K-TS.P 117.59,106 134,106 135.62,104.38 K-REV.P 140.38,104.38 143,107 148,107 151,104 151,87 141.09,77.09 K-BR.P 133.38,81 119.88,81 K-CN.P 115.97,76.97 v106,67 | v91,61 95.25,56.75 K-BZ.P 96.38,51 114.84,51 K-BP1.P 117.1,51 136.15,51 K-BP.P | BP.2 177.36,6 166,6 163.74,8.26 BP1.2 | v183,20 183,31 v165,49
A0
  Top 0.813: ATMEGA328P.23 90.96,90.74 112.79,112.57 118.06,112.57 123.94,118.44 JP1.6 JP1.5 128.63,128.93 R-A0.1 130.92,127.93 167.16,127.93 180.98,141.75 A-1.3
  Bottom 0.813: A-1.3 186,137.74 186,124 189.09,120.91 A-2.3
A1
  Top 0.813: ATMEGA328P.24 91.05,93.28 112.31,114.53 117.49,114.53 121.4,118.44 JP1.8 JP1.7 121.4,125.25 R-A1.1 126.92,130.77 165.86,130.77 175.9,140.81 A-1.4
  Bottom 0.813: A-1.4 184,134.66 184,121 189.17,115.83 A-2.4
A2
  Top 0.813: ATMEGA328P.25 91.96,95.82 112.64,116.5 115.92,116.5 118.86,119.44 JP1.10 JP1.9 122.92,128.3 R-A2.1 125.31,132 165,132 170.82,137.82 A-1.5
  Bottom 0.813: A-1.5 181,132.57 181,119.53 A-2.5
A3
  Top 0.813: ATMEGA328P.26 92.59,98.36 114.93,120.7 115.32,120.7 JP1.12 JP1.11 116.32,126.85 R-A3.1 122.47,133 155.99,133 A-1.6
  Bottom 0.813: A-1.6 178,130.5 178,117 189.33,105.67 A-2.6
A4
  Top 0.813: ATMEGA328P.27 89.28,100.9 106.97,118.58 110.51,118.58 113.62,121.7 JP1.14 JP1.13 113.78,128.15 R-A4.1 119.85,134.22 154.22,134.22 160.66,140.66 A-1.7
  Bottom 0.813: A-1.7 176,127.42 176,113 188.41,100.59 A-2.7
A5
  Top 0.813: ATMEGA328P.28 105.22,122.7 110.24,122.7 JP1.16 JP1.15 110.92,124.56 R-A5.1
  Bottom 0.813: A-2.8 189.49,95.51 172,113 172,126.33 A-1.8 155.25,142.75 149,149 107,149 104,146 104,136.05 R-A5.1
ARD-BP1
  Bottom 0.813: ATMEGA328P.13 74.38,69 74,69 74,29 81,22 81,19 128,19 135,26 141.72,26 LED-BP1.K
ARD-BP2  (via drill 0.35)
  Top 0.813: ATMEGA328P.14 80.76,68 v83,68 | v147,34 148.03,32.97 148.4,32.97 158.71,22.66 LED-BP.K
  Bottom 0.813: v83,68 84.03,66.97 84.03,28.6 85.6,27.04 117.97,27.04 119,26 123,26 130.03,33.03 143.92,33.03 144.89,34 v147,34
BRAKE
  Bottom 0.813: ATMEGA328P.11 78.38,78 80,78 81,77 81,29 86,24 120,24 121.85,22.15 LED-BR.K
BRAKEIN  (via drill 0.35)
  Top 0.813: v159,68 160.25,69.25 OUT.7 179.5,57 v168,57 | v153,62 148,57 136,57 136,58.08 K-BR.S | v162,29 v159,26 | v154,20 152,18 138,18 v134,14
  Bottom 0.813: v159,68 v153,62 | v168,57 162,51 v162,29 | v159,26 159,25 v154,20 | v134,14 132,12 128,12 125.82,9.82 BR-12.1
BUZZER
  Bottom 0.813: ATMEGA328P.12 74.84,72 73,72 72,71 72,28 78,22 78,17 130,17 133.14,20.14 LED-BZ.K
BUZZERIN  (via drill 0.35)
  Top 0.813: v145,40 150,45 v174,45 168,39 154,39 v153,38 | v153,32 157,28 v157,27
  Bottom 0.813: K-BZ.S 93.69,40 v145,40 | v174,45 177.93,48.93 OUT.3 | v153,38 v153,32 | v157,27 152,22 152,18 147,13 144,13 142.28,11.28 BZ.1
CONTACT  (via drill 0.35)
  Top 0.813: v148,30 135,17 112,17 110.42,18.58 LED-CN.K
  Bottom 0.813: ATMEGA328P.6 83.58,90.74 84.8,91.96 90.04,91.96 100,82 100,56 102,54 116.05,54 116.18,54.13 143.87,54.13 148,50 v148,30
CONTACTIN  (via drill 0.35)
  Top 0.813: v152,74 157.41,79.41 OUT.9 184.34,72 v170,72 | v167,67 v162,62 | v159,34 160,34 166,28 166,20 v165,19 | v153,17 150,14 v137,14
  Bottom 0.813: v152,74 152,64 147,59 113.77,59 K-CN.S | v170,72 167,69 v167,67 | v162,62 162,57 153,48 153,40 v159,34 | v165,19 163,17 v153,17 | v137,14 135,16 134,16 131,13 113,13 109.36,9.36 CN.1
D9
  Top 0.813: ATMEGA328P.15 88.42,70.42 92,74 92,88 113,109 120,109 129.02,118.02 JP1.2 JP1.1 171.24,124.24 181,134 182.38,134 A-1.1
  Bottom 0.813: A-1.1 197,136.9 197,134 194.07,131.07 A-2.1
D10
  Top 0.813: ATMEGA328P.16 87.96,72.96 90,75 90,88 113,111 118.78,111 126.48,118.7 JP1.4 JP1.3 126.48,124.48 128,126 131.49,126 131.52,125.97 169.27,125.97 A-1.2
  Bottom 0.813: A-1.2 189.31,146 195,146 198.58,142.42 198.58,131 193.57,125.99 A-2.2
GND
  Top 0.813: C2.2 67.9,81.64 C1.1 | ATMEGA328P.8 74.62,85.66 74.16,86.12 67.86,86.12 C1.1 | C1.1 65.23,84.31 PROGRAMMER.12 PROGRAMMER.11 58.43,82.99 TVS-AR.1 49.88,88.2 5VC-2.- 36.61,88.2 5VC1.- 36.21,86.21 PAD4.1 PAD1.1 25,126.84 TVS-5V.1 | 0V-SCREW.1 0V-SCREW.2 0V-SCREW.3 0V-SCREW.4 0V-SCREW.5 0V-SCREW.6 | TVS-5V.1 29.51,138.79 0V-SCREW.1 | 12V-C.- 19.43,131.35 TVS-5V.1 | TVS-5V.1 35.38,125.49 TVS-12V1.2 TVS-12V.2 | 0V-SCREW.1 40.43,141.81 12V-SUPPLY.2 42.54,141.87 44.88,144.22 51.12,144.22 12-V-SUPPLY.2 | QBP.1 18.71,46.73 18.93,46.96 20.18,46.96 20.4,46.73 QRT.1 25.71,46.73 25.93,46.96 27.18,46.96 27.4,46.73 QBZ.1 32.71,46.73 32.93,46.96 34.18,46.96 34.4,46.73 QBR.1 39.71,46.73 39.93,46.96 41.18,46.96 41.4,46.73 QCN.1 46.71,46.73 46.93,46.96 48.18,46.96 48.4,46.73 QREV.1 53.71,46.73 53.93,46.96 55.18,46.96 55.4,46.73 QTS.1 | R-A1.2 125.76,137.23 R-A2.2 122.76,137.07 R-A3.2 115.08,137.07 R-A4.2 111.08,136.91 R-A5.2 110.92,137.08 110,138 109,138 108,137 108,129.33 LED-R3.1 94.76,116.09 LED-R4.1 90.09,116.09 82,108 82,90 83.8,88.2 ATMEGA328P.22 | R-A1.2 126.76,136.55 R-A0.2 | R-A1.2 125.92,139.96 5V1.2 5V1.1 5V1.3 5V1.4 5V1.6 | 5V1.6 5V1.5 | 5V1.7 5V1.8 | 5V1.8 5V1.6 | 5V1.8 5V1.10 | 5V1.10 5V1.12 | 5V1.12 5V1.14 | 5V1.14 5V1.16 5V1.15 | 5V1.13 5V1.14 | 5V1.11 5V1.12 | 5V1.9 5V1.10
  Bottom 0.813: ATMEGA328P.8 81.34,85.66 82,85 82.76,85 ATMEGA328P.22 | QBP.1 19.65,48.73 19.65,56.39 22.16,58.9 22.16,72.16 PAD4.1 | R-A0.2 138,128.47 138,120 144,114 159.64,114 171,102.64 171,102 178,95 181.25,95 OUT.10 195,81.25 195,76 193.33,74.33 OUT.8 195,71.08 195,66 193.17,64.17 OUT.6 195,60.92 195,57 192.01,54.01 OUT.4 195,50.77 195,46 192.85,43.85 OUT.2
LED5V
  Top 0.813: POWER1.K 85.27,123.71 LED-R4.2
LED12V
  Top 0.813: LED-R3.2 90.46,128.33 POWER.K
N$3
  Bottom 0.813: FUSE-A1.2 44.97,128.92 42.53,131.35 TVS-12V.1 43.24,133.35 48.01,133.35 56.5,141.84 12-V-SUPPLY.1 62.64,141.84 FUSE-A.2A
N$4
  Top 0.813: OK-BR.1 43.05,19.87 43.05,19.36 44.77,17.65 51.29,17.65 53.87,15.07 R-BR.1
N$5
  Bottom 0.813: FUSE-5V.2A 76.01,118.99 73,122 48.73,122 FUSE-5V1.1 43.73,117 40,117 33.27,123.73 TVS-5V.2 29.51,99.51 PAD3.1
N$8
  Top 0.813: R-REV.1 64.16,16.07 62.58,17.65 60.77,17.65 60.05,18.36 60.05,18.87 OK-RV.1
N$10
  Top 0.813: LED-RV.A 100,20.73 96.92,17.65 69.77,17.65 69.05,18.36 69.05,20.95 68,22 63.08,22 OK-RV.2
N$11
  Bottom 0.813: LED-BR.A 133.66,30 146.63,30 147.6,29.04 157.97,29.04 168,19 164,15 158,15 156,13 156,4 61.29,4 56.62,8.67 56.33,8.67 45,20 45.19,20.19 OK-BR.2
N$12
  Top 0.813: OK-BR.3 R-BRT.2
N$13
  Top 0.813: K-BR.2 130.99,74.99 128,72 128,58 127,57 86,57 83.54,54.54 45.91,54.54 40.13,60.31 D-BR.A
  Bottom 0.813: OK-BR.4 42.73,30.89 43.05,31.2 43.05,39.84 42.33,40.55 42.3,40.55 QBR.3 38.65,44.62 37.15,46.11 37.15,59.21 D-BR.A
N$14
  Top 0.813: R-BRT.1 45.79,42.7 45.03,42.7 42.26,45.47 QBR.2
N$18
  Top 0.813: R-TS.1 67.73,15.47 OK-TS.1
N$19
  Top 0.813: LED-TS.A 88.29,20.73 87.08,19.51 86.06,19.51 85.39,20.19 OK-TS.2
N$22
  Top 0.813: OK-TS.3 68.95,29.13 68.95,29.64 66.88,31.71 R-TST.2
N$23
  Top 0.813: R-TST.1 60.83,43.25 61.15,43.57 61.15,45.06 QTS.2
N$24
  Top 0.813: K-TS.2 97,89.3 97,77 87,67 65.78,67 63,64.22 63,63 60.31,60.31 D-TS.A
  Bottom 0.813: OK-TS.4 67.73,36.12 QTS.3 59.65,44.62 58.15,46.11 58.15,59.37 D-TS.A
N$26
  Top 0.813: OK-RV.3 59.95,29.13 59.95,29.64 57.88,31.71 R-REVT.2
N$28
  Top 0.813: R-REVT.1 54.55,41.94 QREV.2
N$29
  Top 0.813: D-REV.A 52.76,60.31 55.08,58 80,58 107,85 126,85 128,87 128,98.98 K-REV.2
  Bottom 0.813: OK-RV.4 54.71,31.83 54.71,36.39 52.27,38.83 52.27,39.84 52.65,40.21 QREV.3 52.65,44.62 51.15,46.11 51.15,59.71 D-REV.A
N$31
  Top 0.813: OK-BZ.1 33.73,19.68 37.13,16.29 48.6,16.29 49.82,15.07 R-BZ.1
N$32
  Bottom 0.813: OK-BZ.2 41.01,20.19 42.23,21.41 71.23,21.41 77.6,15.04 131.4,15.04 134.1,17.74 134.1,19.11 136,21 135.95,21 LED-BZ.A
N$33
  Top 0.813: R-BZT.2 42.27,34.93 41.32,34.93 40.61,34.22 40.61,32.15 OK-BZ.3
N$34
  Top 0.813: QBZ.2 35.26,45.47 38.03,42.7 42.13,42.7 R-BZT.1
N$35
  Top 0.813: K-BZ.2 84.02,53 37,53 32.86,57.14 32.86,59.38 D-BZ.A
  Bottom 0.813: OK-BZ.4 33.73,42.12 QBZ.3 31.65,44.62 30.15,46.11 30.15,58.54 D-BZ.A
N$37
  Top 0.813: OK-CN.1 52.05,19.87 52.05,19.36 54.77,16.65 57.26,16.65 58.84,15.07 R-CN.1
N$38
  Top 0.813: LED-CN.A 112.14,20.73 110.92,21.95 103.95,21.95 94.85,12.85 64.2,12.85 60.37,16.68 58.77,16.68 55.27,20.19 OK-CN.2
N$39
  Top 0.813: OK-CN.3 53.49,28.59 R-CNT.2
N$40
  Top 0.813: R-CNT.1 47.55,45.27 QCN.2
N$41
  Top 0.813: K-CN.2 99.99,74.99 81,56 52.74,56 49.87,58.87 47.87,58.87 46.43,60.31 D-CN.A
  Bottom 0.813: OK-CN.4 49.05,30.49 48.66,30.49 46.71,32.43 46.71,39.84 45.65,40.9 QCN.3 44.15,45.69 44.15,59.04 D-CN.A
N$43
  Top 0.813: R-BP1.1 45.02,12 32.41,12 24.73,19.68 OK-RD.1
N$44  (via drill 0.35)
  Top 0.813: v62,6 v41,6
  Bottom 0.813: LED-BP1.A 143.8,15 140,15 139,14 139,7 138,6 v62,6 | v41,6 27.27,19.73 OK-RD.2
N$45
  Top 0.813: R-RBP1T.2 41.83,30.71 40.83,29.71 40.83,28.71 40,27.88 40,27 37,24 31.08,24 OK-RD.3
N$46
  Top 0.813: R-RBP1T.1 39.88,39.33 38.66,40.55 31.47,40.55 QRT.2
N$47
  Top 0.813: K-BP1.2 105,42.78 105,30 103,28 88,28 82,34 82,48 79,51 32,51 29,54 29,56.91 D-BP1.A
  Bottom 0.813: OK-RD.4 24.73,44.12 QRT.3 24.65,44.62 23.15,46.11 23.15,57.87 D-BP1.A
N$55
  Top 0.813: R-BP.1 32.93,15.07 29,19 29,22 28,23 18,23 16.73,21.73 OK-BP.1
N$56  (via drill 0.35)
  Top 0.813: LED-BP.A 166.98,15 171,15 172,14 172,4 171,3 40,3 v37,6
  Bottom 0.813: v37,6 33.46,6 OK-BP.2
N$57
  Top 0.813: OK-BP.3 23.17,31.71 R-BPT.2
N$58
  Top 0.813: R-BPT.1 25.69,39.33 QBP.2
N$59
  Top 0.813: K-BP.2 126,42.48 126,29 123,26 82,26 77,31 77,48 75.97,49.03 20.68,49.03 20.68,54.4 19.76,55.31 D-BP.A
  Bottom 0.813: OK-BP.4 16.73,43.27 QBP.3 17.65,44.62 16.15,46.11 16.15,56.71 D-BP.A
N$66
  Top 0.813: PROGRAMMER.9 PROGRAMMER.10
N$76
  Top 0.813: K-BP.O 170.43,35.57 182,24 186,24 191,19 191,12 187.84,8.84 BP.3
OUT-BKP2  (via drill 0.35)
  Top 0.813: BP.1 175.2,25.8 v168,33 | v164,41 162,43 154,43 150,39 133,39 131.29,37.29 K-BP.S
  Bottom 0.813: v168,33 164,37 v164,41
PROGRAMMERSL1
  Top 0.813: PROGRAMMER.2 PROGRAMMER.1 66.09,103.35 RST-C.+
REVERSE  (via drill 0.35)
  Top 0.813: v150,30 148,32 132,32 124,24 101.55,24 LED-RV.K
  Bottom 0.813: ATMEGA328P.5 83.58,93.28 84.8,94.5 94.5,94.5 104,85 104,57 105,56 146,56 150,52 v150,30
REVERSEIN  (via drill 0.35)
  Top 0.813: K-REV.S 141.72,79.64 141.72,73.35 142.63,72.45 143.92,72.45 146.42,74.95 182.59,38.77 OUT.1 191.75,23.25 197,18 197,14 v196,13 | v159,13 158,12 96,12 92.9,8.9 RV.1
  Bottom 0.813: v196,13 v159,13
RST
  Top 0.813: RST-R.2 59.28,99.83 RST-C.- 75.14,106.64 ATMEGA328P.1
RX
  Top 0.813: PROGRAMMER.5 PROGRAMMER.6
  Bottom 0.813: PROGRAMMER.6 66.36,96 73.44,96 ATMEGA328P.2
TSAL  (via drill 0.35)
  Top 0.813: LED-TS.K 83.3,24 74,24 73,25 73,35 68,40 v67,40
  Bottom 0.813: ATMEGA328P.4 74.62,95.82 69.47,90.66 61.76,90.66 61.02,89.92 61.02,75.02 61,75 61,71 67,65 v67,40
TSALIN  (via drill 0.35)
  Top 0.813: K-TS.S 116.08,90.08 120,94 v126,94 | v149,82 143,82 v141,84 | OUT.5 192.91,59.09 198.58,53.42 198.58,12 193,6.42 v193,4 | v54,9 56,11 74.28,11 TS.1
  Bottom 0.813: OUT.5 171.91,59.09 v149,82 | v141,84 131,84 126,89 v126,94 | v193,4 191,2 59,2 54,7 v54,9
TX
  Top 0.813: PROGRAMMER.3 PROGRAMMER.4 66.18,98.36 ATMEGA328P.3
XTAL1
  Top 0.813: ATMEGA328P.9 77.08,84.38 CRYSTAL.2 73.06,83.9 C1.2
XTAL2
  Top 0.813: ATMEGA328P.10 77.06,79.3 CRYSTAL.1 69.41,79.3 C2.1

### Text on the board
tPlace: DESIGNED BY: / Piyush Ranjan / Ansh Khanna / Harish / Lucky Kumar / Satyam / Sachin | main-pcb@aveon | 2026 V1.0 | C:/Users/rpiyu/Desktop/teamaveonmonochrome.bmp
bPlace: PREVIOUS VERSION / Designed By: / Navneet Kumar / Tanmay Raj / Saurabh Pandey / Shashwat Verma